# Altium schematic sheet 3_MotorDriver.SchDoc
size A3; Organization: Altium Limited; Address1: L3, 12a Rodborough Rd; Address2: Frenchs Forest; Address3: NSW; Address4: Australia 2086
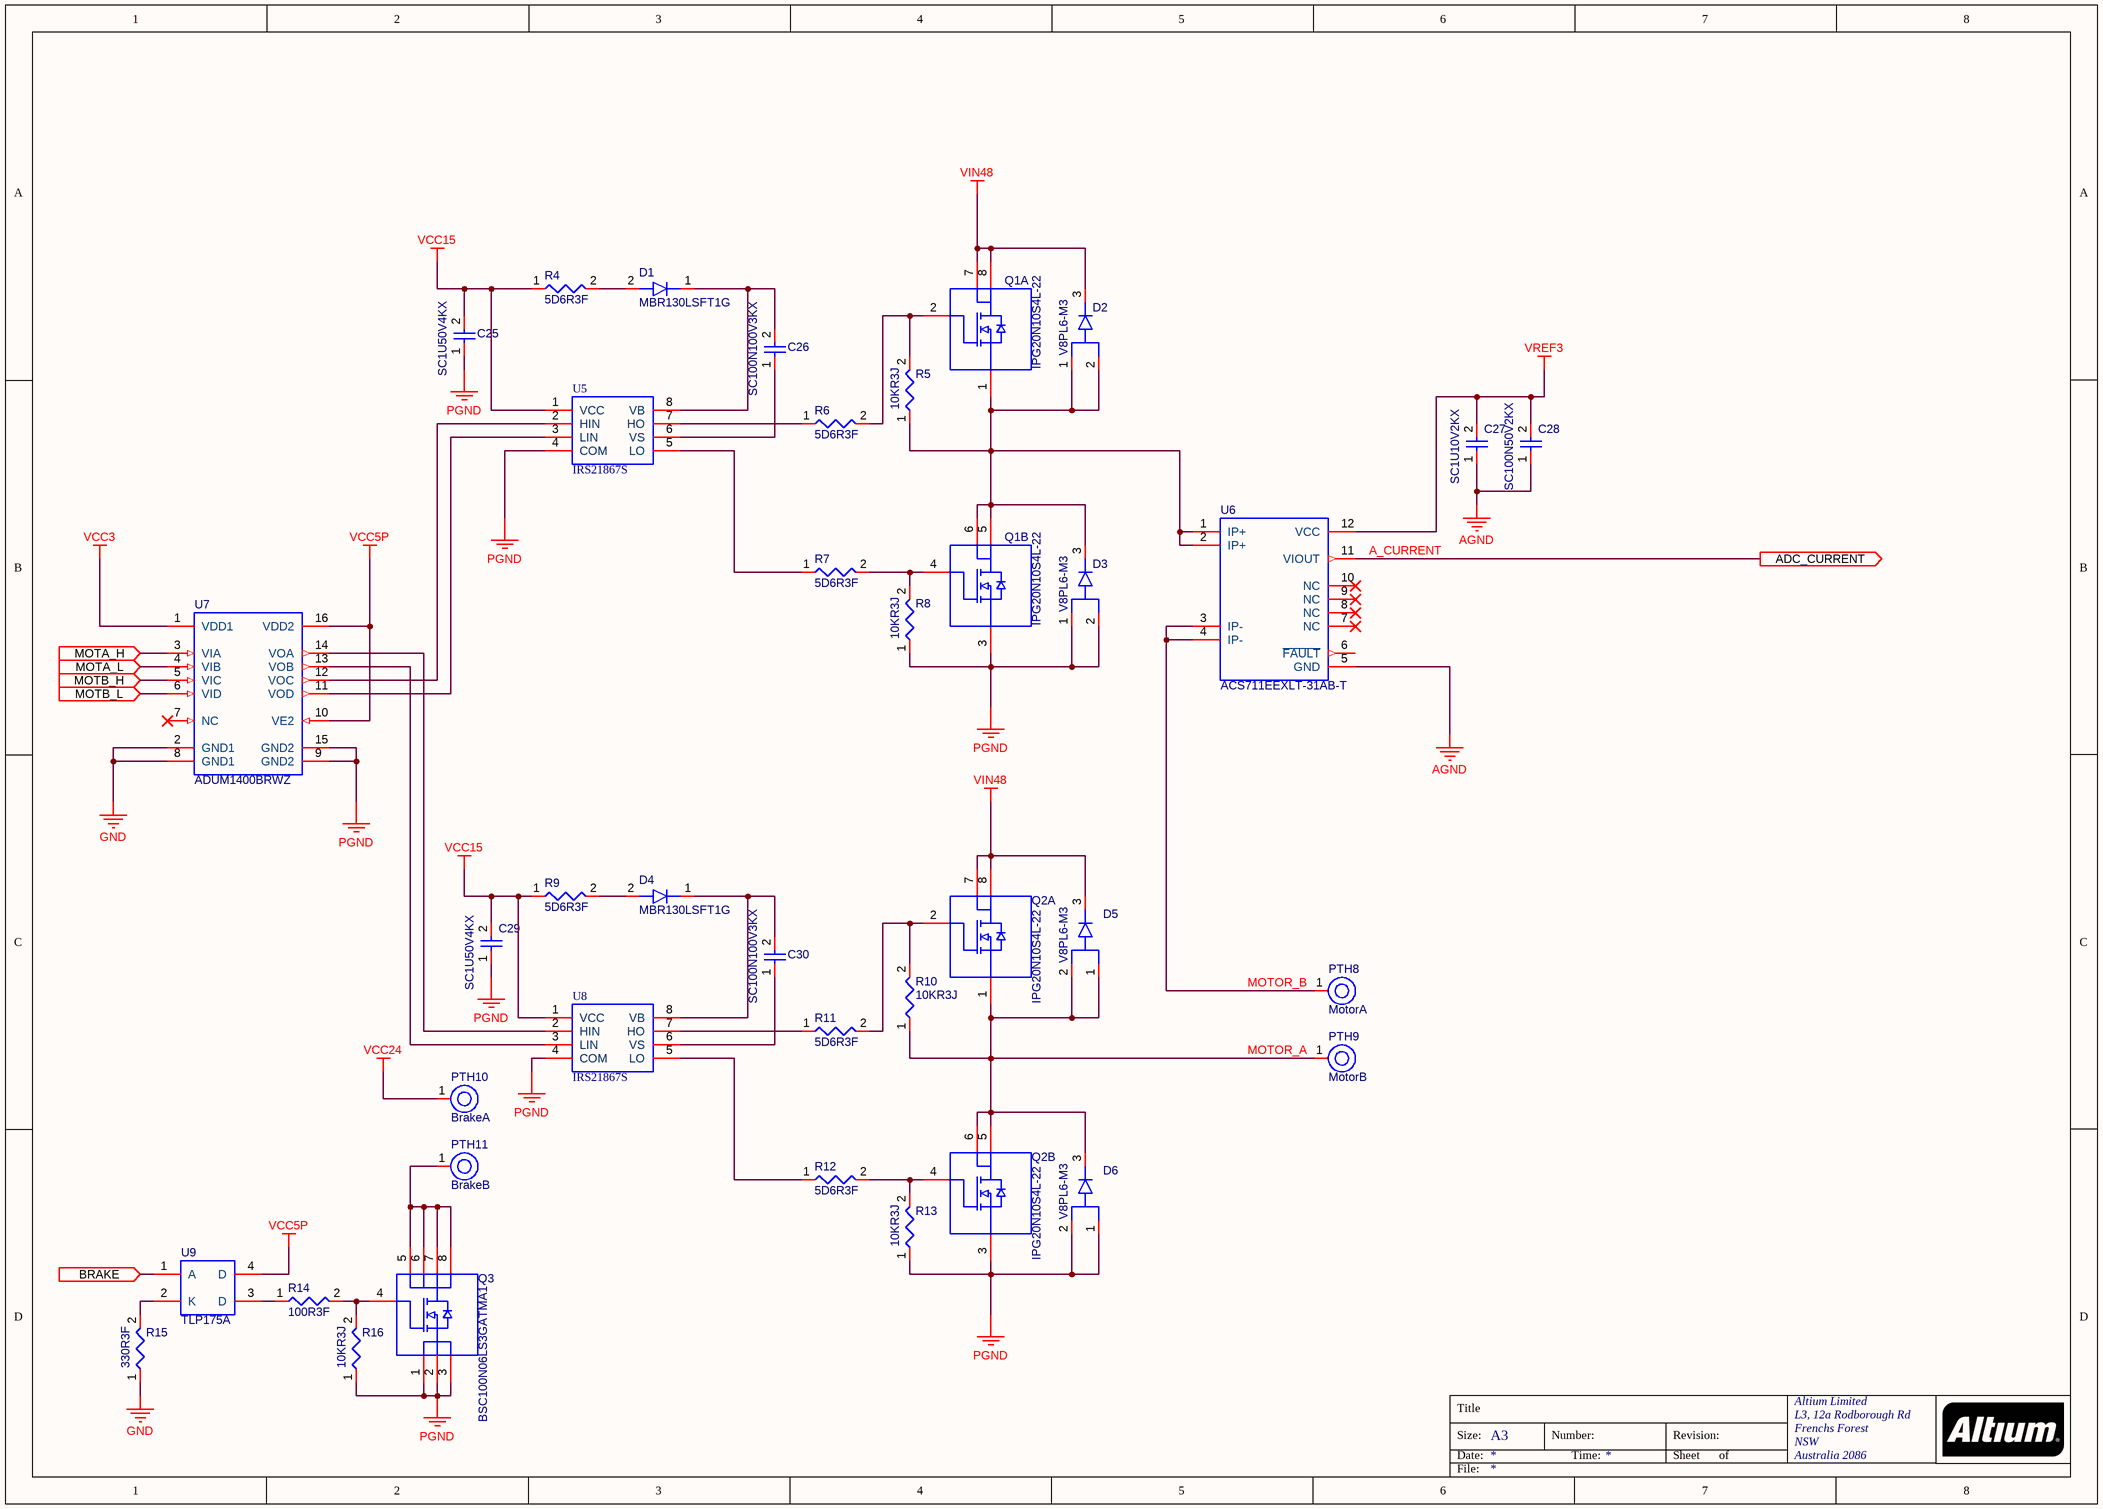
[diagram p0: 3_MotorDriver.SchDoc]

## Parts
C25  SC1U50V4KX  [CAPC0805(2012)145_L]
C26  SC100N100V3KX  [CAPC0603(1608)100_L]
C27  SC1U10V2KX  [CAPC0402(1005)60_L]
C28  SC100N50V2KX  [CAPC0402(1005)60_L]
C29  SC1U50V4KX  [CAPC0805(2012)145_L]
C30  SC100N100V3KX  [CAPC0603(1608)100_L]
D1  MBR130LSFT1G  [SOD-123LF]
D2  V8PL6-M3  [DFN442P610X120-3L]
D3  V8PL6-M3  [DFN442P610X120-3L]
D4  MBR130LSFT1G  [SOD-123LF]
D5  V8PL6-M3  [DFN442P610X120-3L]
D6  V8PL6-M3  [DFN442P610X120-3L]
PTH8  MotorA  [POWERHOLE-LP]  (no BOM)
PTH9  MotorB  [POWERHOLE-LP]  (no BOM)
PTH10  BrakeA  [POWERHOLE-LP]  (no BOM)
PTH11  BrakeB  [POWERHOLE-LP]  (no BOM)
Q1  IPG20N10S4L-22  [PG-TDSON-8-4]  (parts A,B of 2)
Q2  IPG20N10S4L-22  [PG-TDSON-8-4]  (parts A,B of 2)
Q3  BSC100N06LS3GATMA1  [PG-TDSON-8-1]
R4  5D6R3F  [RESC0603(1608)_L]
R5  10KR3J  [RESC0603(1608)_L]
R6  5D6R3F  [RESC0603(1608)_L]
R7  5D6R3F  [RESC0603(1608)_L]
R8  10KR3J  [RESC0603(1608)_L]
R9  5D6R3F  [RESC0603(1608)_L]
R10  10KR3J  [RESC0603(1608)_L]
R11  5D6R3F  [RESC0603(1608)_L]
R12  5D6R3F  [RESC0603(1608)_L]
R13  10KR3J  [RESC0603(1608)_L]
R14  100R3F  [RESC0603(1608)_L]
R15  330R3F  [RESC0603(1608)_L]
R16  10KR3J  [RESC0603(1608)_L]
U5  IRS21867S  [SOIC127P600X175-8L]
U6  ACS711EEXLT-31AB-T  [ACS711EX]
U7  ADUM1400BRWZ  [SOIC127P1030X265-16L]
U8  IRS21867S  [SOIC127P600X175-8L]
U9  TLP175A  [SOP254P700X220-4L]

## Ports
ADC_CURRENT (out), BRAKE (in), MOTA_H (in), MOTA_L (in), MOTB_H (in), MOTB_L (in)

## Nets
AGND: C27.1 C28.1 U6.5(GND)
GND: R15.1 U7.2(GND1) U7.8(GND1)
PGND: C25.1 C29.1 D3.1(A1) D3.2(A2) D6.1(A1) D6.2(A2) Q1.3 Q2.3 Q3.1 Q3.2 Q3.3 R8.1 R13.1 R16.1 U5.4(COM) U7.9(GND2) U7.15(GND2) U8.4(COM)
VCC3: U7.1(VDD1)
VCC5P: U7.10(VE2) U7.16(VDD2) U9.4(D)
VCC15: C25.2 C29.2 R4.1 R9.1 U5.1(VCC) U8.1(VCC)
VCC24: PTH10.1(H1)
VIN48: D2.3(K) D5.3(K) Q1.7 Q1.8 Q2.7 Q2.8
VREF3: C27.2 C28.2 U6.12(VCC)
A_CURRENT: U6.11(VIOUT) ; port ADC_CURRENT
BRAKE: U9.1(A) ; port BRAKE
MOTA_H: U7.3(VIA) ; port MOTA_H
MOTA_L: U7.4(VIB) ; port MOTA_L
MOTB_H: U7.5(VIC) ; port MOTB_H
MOTB_L: U7.6(VID) ; port MOTB_L
MOTOR_A: D5.1(A1) D5.2(A2) D6.3(K) PTH9.1(H1) Q2.1 Q2.5 Q2.6 R10.1
MOTOR_B: PTH8.1(H1) U6.3(IP-) U6.4(IP-)
NetC26_1: C26.1 U5.6(VS)
NetC26_2: C26.2 D1.1(K) U5.8(VB)
NetC30_1: C30.1 U8.6(VS)
NetC30_2: C30.2 D4.1(K) U8.8(VB)
NetD1_2: D1.2(A) R4.2
NetD2_1: D2.1(A1) D2.2(A2) D3.3(K) Q1.1 Q1.5 Q1.6 R5.1 U6.1(IP+) U6.2(IP+)
NetD4_2: D4.2(A) R9.2
NetPTH11_1: PTH11.1(H1) Q3.5 Q3.6 Q3.7 Q3.8
NetQ1_2: Q1.2 R5.2 R6.2
NetQ1_4: Q1.4 R7.2 R8.2
NetQ2_2: Q2.2 R10.2 R11.2
NetQ2_4: Q2.4 R12.2 R13.2
NetQ3_4: Q3.4 R14.2 R16.2
NetR6_1: R6.1 U5.7(HO)
NetR7_1: R7.1 U5.5(LO)
NetR11_1: R11.1 U8.7(HO)
NetR12_1: R12.1 U8.5(LO)
NetR14_1: R14.1 U9.3(D)
NetR15_2: R15.2 U9.2(K)
NetU5_2: U5.2(HIN) U7.12(VOC)
NetU5_3: U5.3(LIN) U7.11(VOD)
NetU7_13: U7.13(VOB) U8.3(LIN)
NetU7_14: U7.14(VOA) U8.2(HIN)

Not connected (* = marked no-connect by the designer): U6 6(~{FAULT}) 7(NC)* 8(NC)* 9(NC)* 10(NC)*; U7 7(NC)*

## Notes on the sheet
- Title
- Size:
- Date:
- A3
- Number:
- Time:
- Revision:
- Sheet
- of
- File:

## Library data of the parts
C25 C29 = CAP(0805)1UF50V: CAP 1uF 50V ±10% 0805(1610 Metric) Thickness 1.2mm SMD
C26 C30 = CAP(0603)100nF100V: CAP 100nF 100V ±10% 0603(1608 Metric) Thickness 1mm SMD
C27 = CAP(0402)1UF10V: CAP 1uF 10V ±10% 0402 (1005 Metric) Thickness 0.6mm SMD
C28 = CAP(0402)100nF50V: CAP 100nF 50V ±10% 0402 (1005 Metric) Thickness 0.6mm SMD
D1 D4 = DIOD-MBR130: 1А 30В [SOD-123FL] / , RoHS, Tape and Reel; Manufacturer: Rohm; Package Reference: ROHM-1SS400CSFH; Datasheet URL: https://www.rohm.com/datasheet/1SS400CSFH/1ss400csfht2ra-e
D2 D3 D5 D6 = VISH-V8PL6-M3: High Current Density Surface Mount / Trench MOS Barrier Schottky Rectifier / Ultra Low VF = 0.34 V at IF = 4 A; Packing: Tape and Reel; IF Max (A): 0.1; trr Max (ns): 4; Configuration: Single; PackageDescription: 3-Pin Small Outline Transistor, Body 1.2 x 0.8 mm, Pitch 0.4 mm; Mounting Technology: Surface Mount; RoHS: TRUE; PackageVersion: Rev. D, 08/2009; ComponentLink2URL: http://www.onsemi.cn/pub_link/Collateral/DAN222M3-D.PDF; ComponentLink3URL: http://www.onsemi.com/pub_link/Collateral/631AA.PDF; ComponentLink3Description: Package Specification; DatasheetVersion: Rev. 6; PackageReference: SOT-723-3-631AA-01; ComponentLink1URL: http://www.onsemi.com/; ComponentLink1Description: Manufacturer URL; ComponentLink2Description: Datasheet
PTH8-PTH11 = PTH-1D2M: 1.2mm hole 2mm pad; Pad diameter (mm): 5; Hole diameter (mm): 2.5
Q1 Q2 = INF_IPG20N06S4L-26: OptiMOS™-T2 Power-Transistor V DS 100 V / R DS(on) max 22 / ID 20 A
Q3 = NEMOS-BSC100N06L: 100 V N-Channel NexFET™ Power MOSFETs
R4 R6 R7 R9 R11 R12 = RES0(0603)_5R6: 5.6R 0.1W 1% 0603 (1608 Metric)  SMD
R5 R8 R10 R13 R16 = RES0(0603)_10K: 10K 0.1W 5% 0603 (1608 Metric)  SMD
R14 = RES0(0603)_100R: 100R 0.1W 1% 0603 (1608 Metric)  SMD
R15 = RES0(0603)_330R: 330R 0.1W 1% 0603 (1608 Metric)  SMD
U5 U8 = MOSDRV_IRS21867S
U6 = ACS711EX: High Accuracy, Hall-Effect Based Current Sensor / IC in High Isolation QFN Package
U7 = ISOL-ADUM1400: ISOLATOR 4ch in
U9 = OPTO-TLP175A